# EAGLE design laser_driver (EAGLE 7.0.0)
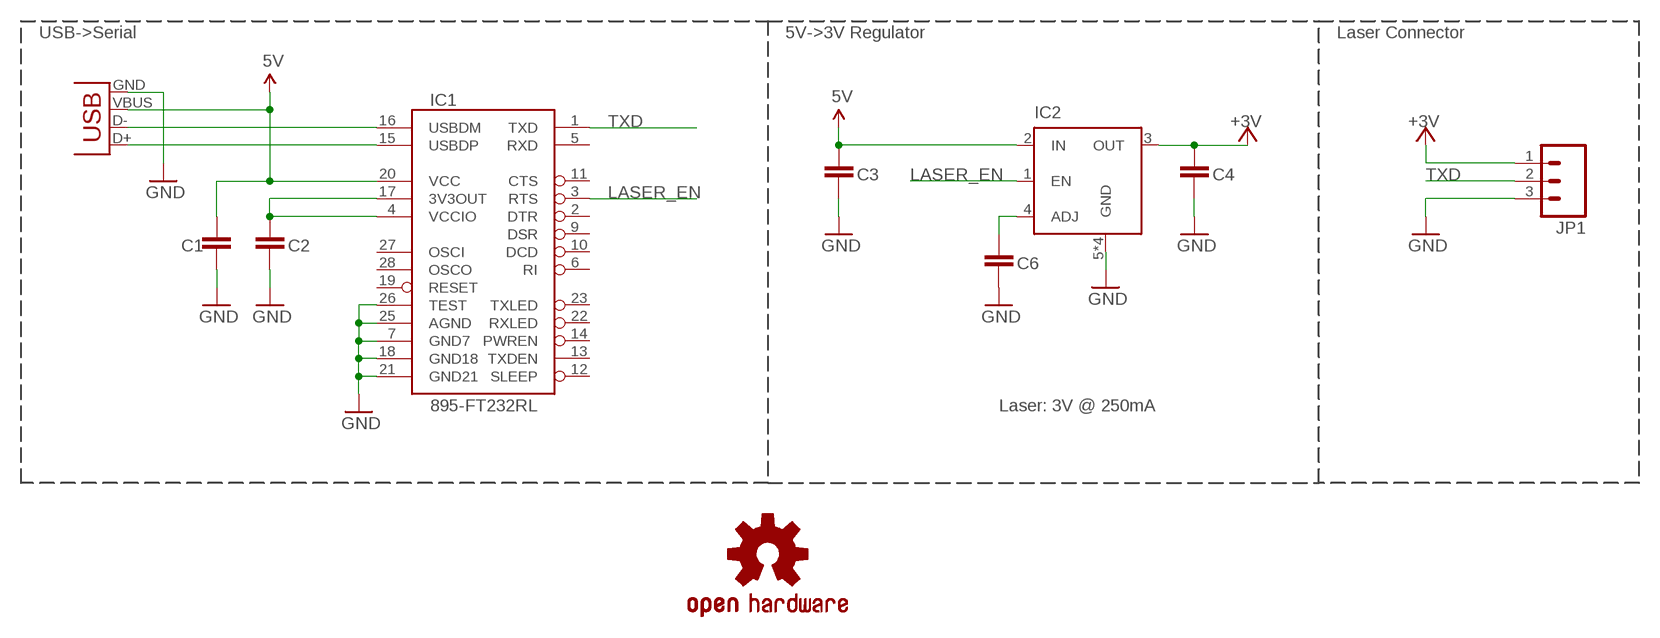
[diagram p0: schematic, sheet 1]

## Parts
C1  C1608X5R1C106M080AB  CAP0603-CAP  [0603-CAP]
C2  C1608X5R1C106M080AB  CAP0603-CAP  [0603-CAP]
C3  C1608X5R1C106M080AB  CAP0603-CAP  [0603-CAP]
C4  C1608X5R1C106M080AB  CAP0603-CAP  [0603-CAP]
C6  VJ0603A471KXQPW1BC  CAP0603-CAP  [0603-CAP]
IC1  895-FT232RL  FT232RLSSOP  [SSOP28DB]
IC2  998-MIC5219-3.0YMM  MIC5219BMM  [MSOP08]
JP1  651-5442251  M03SCREW  [SCREWTERMINAL-3.5MM-3]
LOGO1  OSHW-LOGOS  [OSHW-LOGO-S]
X1  798-ZX62RD-AB-5P8  USB-MICROB  [USB-MICROB]

## Nets
3.3V [power]: C2.1 IC1.4(VCCIO) IC1.17(3V3OUT)
5V: C1.1 C3.1 IC1.20(VCC) IC2.2(IN) X1.VBUS
+3V: C4.1 IC2.3(OUT) JP1.1
GND [power]: C1.2 C2.2 C3.2 C4.2 C6.2 IC1.7(GND7) IC1.18(GND18) IC1.21(GND21) IC1.25(AGND) IC1.26(TEST) IC2.5(GND) IC2.6(GND) IC2.7(GND) IC2.8(GND) JP1.3 X1.GND
LASER_EN: IC1.3(RTS) IC2.1(EN)
N$2: C6.1 IC2.4(ADJ)
TXD: IC1.1(TXD) JP1.2
USB_D+: IC1.15(USBDP) X1.D+
USB_D-: IC1.16(USBDM) X1.D-
Unconnected: IC1.2(DTR) IC1.5(RXD) IC1.6(RI) IC1.9(DSR) IC1.10(DCD) IC1.11(CTS) IC1.12(SLEEP) IC1.13(TXDEN) IC1.14(PWREN) IC1.19(RESET) IC1.22(RXLED) IC1.23(TXLED) IC1.27(OSCI) IC1.28(OSCO)

## Notes on the sheet
- USB->Serial | 5V->3V Regulator | Laser Connector
- Laser: 3V @ 250mA

## Library data of the parts
C1 C2 = SparkFun:CAP: Capacitor Standard 0603 ceramic capacitor, and 0.1" leaded capacitor.
C3 C4 C6 = SparkFun-Passives:CAP: Capacitor Standard 0603 ceramic capacitor, and 0.1" leaded capacitor.
IC1 = SparkFun:FT232RL: USB UART FT232RL 4th Generation USB UART (USB <-> Serial) Controller. Spark Fun Electronics SKU : COM-00650
IC2 = v-reg-micrel:MIC5219BMM: VOLTAGE REGULATOR; MF: ALTERA CORPORATION; MPN: MIC5219BMM; OC_FARNELL: unknown; OC_NEWARK: 76C0464
JP1 = SparkFun-Connectors:M03: Header 3 Standard 3-pin 0.1" header. Use with straight break away headers (SKU : PRT-00116), right angle break away headers (PRT-00553), swiss pins (PRT-00743), machine pins (PRT-00117), and female headers (PRT-00115). Molex polarized connector foot print use with SKU : PRT-08232 with associated crimp pins and housings.
LOGO1 = SparkFun-Aesthetics:OSHW-LOGO: Open Source Hardware Logo This logo indicates the piece of hardware it is found on incorporates a OSHW license and/or adheres to the definition of open source hardware found here: http://freedomdefined.org/OSHW
X1 = SparkFun:USB: USB Connectors USB-B-PTH is fully proven SKU : PRT-00139 USB-miniB is fully proven SKU : PRT-00587 USB-A-PCB is untested. USB-A-H is throughly reviewed, but untested. Spark Fun Electronics SKU : PRT-00437 USB-B-SMT is throughly reviewed, but untested. Needs silkscreen touching up. USB-A-S has not been used/tested USB-MB-H has not been used/tested

## Net classes
1 power: width 0.254 mm

## Board
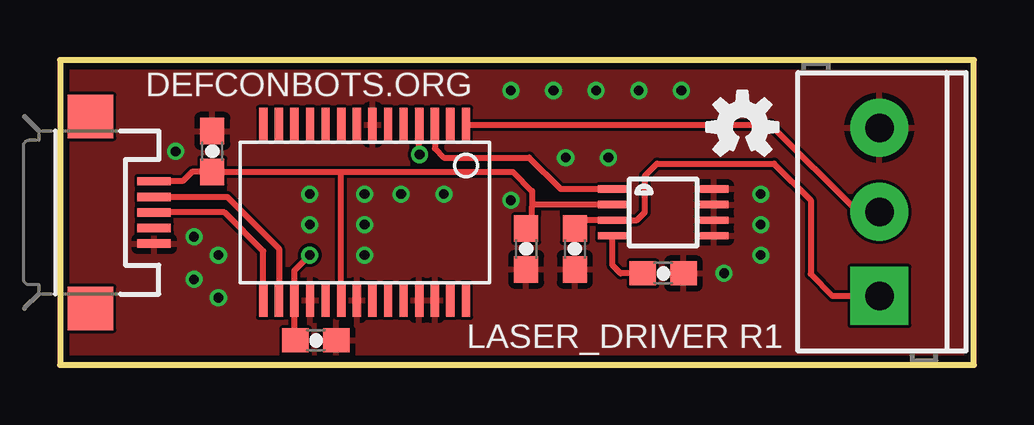
[diagram p1: board, top side]
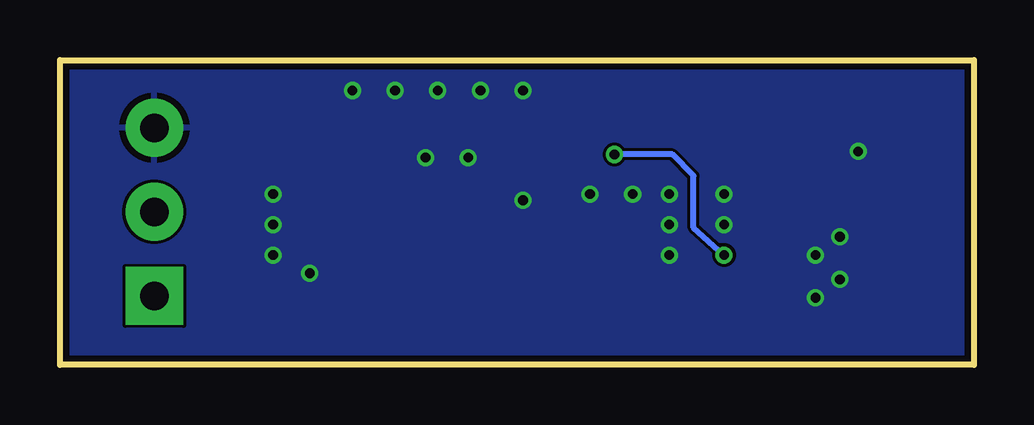
[diagram p2: board, bottom side, seen from below]

Size 38.1 x 12.7 mm. Coordinates in mm from the lower left corner, seen from the top.
Outline: 0,0 38.1,0 38.1,12.7 0,12.7 0,0
Copper layers (1*16): Top 0.035mm / dielectric 1.5mm / Bottom 0.035mm
Design rules "dirt_cheap_dirty_boards.v1": minimum track width 5mil, minimum drill 12mil, track to track 5mil, track to pad 5mil, pad to pad 5mil, via to via 5mil, smd to smd 0mil, copper to edge 10mil, drill to drill 10mil, minimum pad ring 10mil, minimum via ring 6mil, stop-mask expansion 2mil, vias tented up to drill 25mil, thermal gap 10mil

### Footprints (pad centres in the part's own frame; a part is rotated, then mirrored left to right if it is on the bottom)
0603-CAP = smd 1.1 x 1: 1 -0.85,0; 2 0.85,0
SSOP28DB = smd 0.348 x 1.397: 1 -4.225,-3.656; 2 -3.575,-3.656; 3 -2.925,-3.656; 4 -2.275,-3.656; 5 -1.625,-3.656; 6 -0.975,-3.656; 7 -0.325,-3.656; 8 0.325,-3.656; 9 0.975,-3.656; 10 1.625,-3.656; 11 2.275,-3.656; 12 2.925,-3.656; 13 3.575,-3.656; 14 4.225,-3.656; 15 4.225,3.656; 16 3.575,3.656; 17 2.925,3.656; 18 2.275,3.656; 19 1.625,3.656; 20 0.975,3.656; 21 0.325,3.656; 22 -0.325,3.656; 23 -0.975,3.656; 24 -1.625,3.656; 25 -2.275,3.656; 26 -2.925,3.656; 27 -3.575,3.656; 28 -4.225,3.656
MSOP08 = smd 0.3 x 1.2: 1 -0.976,-2.113; 2 -0.326,-2.113; 3 0.324,-2.113; 4 0.974,-2.113; 5 0.974,2.112; 6 0.324,2.112; 7 -0.326,2.112; 8 -0.976,2.112
SCREWTERMINAL-3.5MM-3 = drill 1.2 pad 2.413 square: 1 0,0 | drill 1.2 pad 2.413: 2 3.5,0; 3 7,0
USB-MICROB = smd 0.35 x 1.4: D+ 0,2.65; D- -0.65,2.65; GND 1.3,2.65; ID 0.65,2.65; VBUS -1.3,2.65 | smd 1.8 x 1.9: MT1 -4,0; MT2 4,0

### Placement (x,y rotation side)
C1  6.35,8.89 90 top
C2  10.67,1.02 0 top
C3  19.43,4.83 270 top
C4  21.46,4.83 270 top
C6  25.15,3.81 0 top
IC1  12.7,6.35 180 top
IC2  25.15,6.35 270 top
JP1  34.16,2.87 90 top
LOGO1  28.45,9.91 0 top
X1  1.27,6.35 270 top

### Tracks (layer width: path | path; a pad name or v marks a point on that pad's centre or on a via)
3.3V  (via drill 0.41)
  Top 0.254: C2.1 9.78,1.06 IC1.17 9.78,3.93 v10.41,4.57 | v14.99,8.76 14.97,8.65 IC1.4
  Bottom 0.254: v10.41,4.57 11.68,5.71 11.68,7.87 12.57,8.76 v14.99,8.76
5V
  Top 0.254: X1.VBUS 5.11,7.65 5.5,8.04 C1.1 11.72,8.04 | 11.72,8.04 18.88,8.04 19.68,7.24 19.68,6.6 | IC2.2 19.76,6.68 19.68,6.6 | IC1.20 11.72,8.04 | C3.1 19.68,5.68 19.68,6.6
+3V
  Top 0.254: C4.1 21.81,6.03 IC2.3 24.06,6.03 24.38,6.35 24.38,7.87 24.89,8.38 29.77,8.38 31.29,6.86 31.29,3.79 32.21,2.87 JP1.1
GND  (via drill 0.41)
  other vias: 4.83,8.89 5.59,5.33 5.59,3.56 6.6,2.79 6.6,4.57 10.41,7.11 10.41,5.84 12.7,7.11 12.7,5.84 12.7,4.57 18.8,6.86 21.08,8.64 22.86,8.64 29.21,7.11 29.21,5.84 29.21,4.57 27.69,3.81 18.8,11.43 20.57,11.43 22.35,11.43 24.13,11.43 25.91,11.43 14.22,7.11 16,7.11
  pour Top: -0.25,13.72 38.86,13.72 38.86,-1.02 -0.25,-1.02
  pour Bottom: -0.25,13.46 38.61,13.46 38.61,-0.25 -0.25,-0.25
LASER_EN
  Top 0.254: IC1.3 15.62,9.01 16,8.64 19.56,8.64 20.87,7.33 IC2.1
N$2
  Top 0.254: C6.1 23.37,3.81 23.03,4.14 IC2.4
TXD
  Top 0.254: IC1.1 29.62,10.01 33.25,6.37 JP1.2
USB_D+
  Top 0.254: IC1.15 8.47,4.73 6.86,6.35 X1.D+
USB_D-
  Top 0.254: X1.D- 6.97,7 9.12,4.84 IC1.16

### Text on the board
tPlace: DEFCONBOTS.ORG | LASER_DRIVER R1